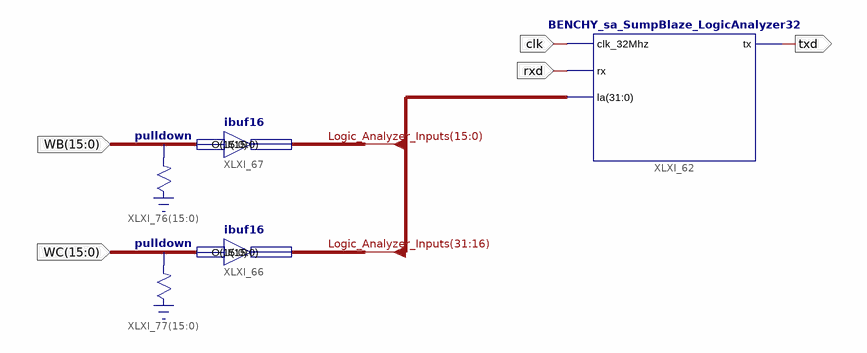
[diagram p0: schematic sheet 1]
// Xilinx ISE schematic Papilio_One_500K.sch (spartan3e) as structural Verilog: 5 symbols, 5 ports
module Papilio_One_500K (
  input  clk,
  input  rxd,
  input  [15:0] WB,
  input  [15:0] WC,
  output txd
);

  wire [31:0] Logic_Analyzer_Inputs;

  BENCHY_sa_SumpBlaze_LogicAnalyzer32 #(.brams(20)) XLXI_62 (
    .clk_32Mhz(clk), .la(Logic_Analyzer_Inputs), .rx(rxd), .tx(txd));
  ibuf16 XLXI_67 (.I(WB), .O(Logic_Analyzer_Inputs[15:0]));
  ibuf16 XLXI_66 (.I(WC), .O(Logic_Analyzer_Inputs[31:16]));
  \pulldown  XLXI_76[15:0] (.O(WB));
  \pulldown  XLXI_77[15:0] (.O(WC));
endmodule
